# EAGLE schematic 4PDTrelay_nice_layout (EAGLE 8.3.2)
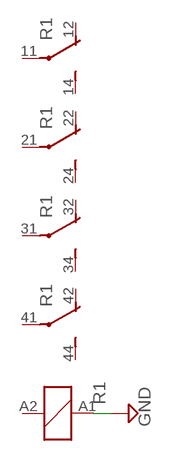
[diagram p0: schematic, sheet 1]

## Parts
R1  PT571R06  [PT-4]

## Nets
GND: R1.A1
Unconnected: R1.11(2:P) R1.12(2:O) R1.14(2:S) R1.21(3:P) R1.22(3:O) R1.24(3:S) R1.31(4:P) R1.32(4:O) R1.34(4:S) R1.41(5:P) R1.42(5:O) R1.44(5:S) R1.A2

## Library data of the parts
R1 = relay_computer_custom:PT5*: Miniature Relay SCHRACK 2 pole 12 A, 3 pole 10 A or 4 pole 6 A DC- or AC-coil Source: http://www.schrack.com/.. 5823.pdf Socked 78604 Source: http://www.schrack.com/.. 5836.pdf; OC_FARNELL: unknown; OC_NEWARK: unknown